# Altium schematic sheet Diagram.SchDoc
size A4; SheetNumber: 1; SheetTotal: 8
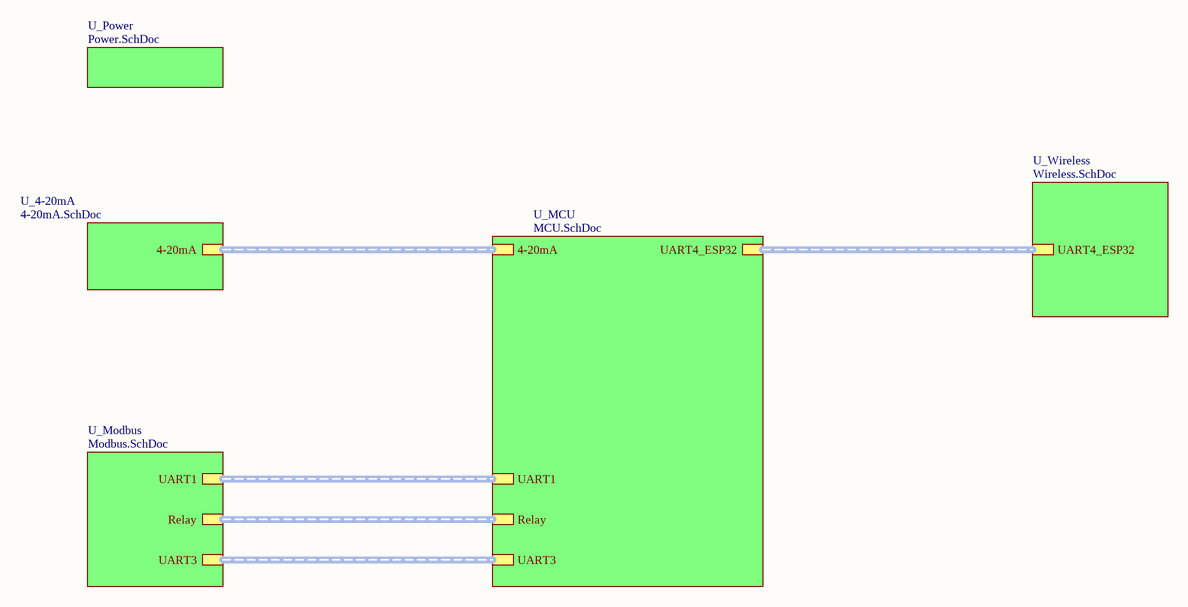
[diagram p0: Diagram.SchDoc]

## Sub-sheets
U_4-20mA = 4-20mA.SchDoc: 4-20mA (harness 4-20mA)
U_MCU = MCU.SchDoc: UART1 (harness UART1), UART3 (harness UART3), Relay (harness Relay), UART4_ESP32 (harness UART4_ESP32), 4-20mA (harness 4-20mA)
U_Modbus = Modbus.SchDoc: UART1 (harness UART1), UART3 (harness UART3), Relay (harness Relay)
U_Power = Power.SchDoc: no entries
U_Wireless = Wireless.SchDoc: UART4_ESP32 (harness UART4_ESP32)

## Buses and harness runs
harness sheet U_4-20mA/4-20mA = sheet U_MCU/4-20mA
harness sheet U_MCU/Relay = sheet U_Modbus/Relay
harness sheet U_MCU/UART1 = sheet U_Modbus/UART1
harness sheet U_MCU/UART3 = sheet U_Modbus/UART3
harness sheet U_MCU/UART4_ESP32 = sheet U_Wireless/UART4_ESP32

## Notes on the sheet
- Title
- Size:
- Date:
- A3
- Number:
- Time:
- Revision:
- Sheet
- of
- NICHIETSUVN.COM <http://NICHIETSUVN.COM>
- R&D
- File: